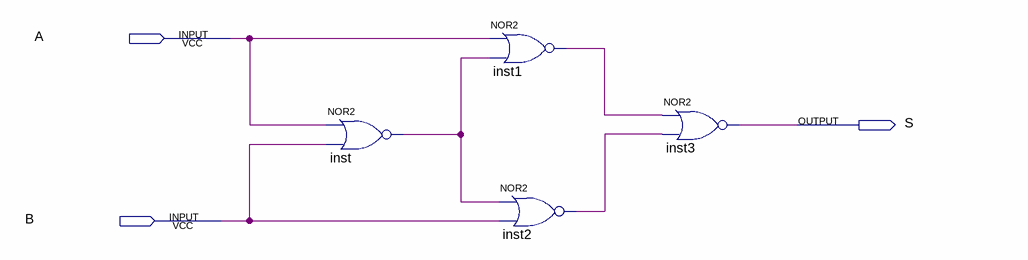
[diagram p0: schematic sheet]
// Quartus schematic AxnorB.bdf as structural Verilog: 4 symbols, 3 pins
module AxnorB (
  input  A,
  input  B,
  output S
);

  wire inst1_out, inst2_out, inst_out;

  nor inst (inst_out, A, B);
  nor inst1 (inst1_out, A, inst_out);
  nor inst2 (inst2_out, inst_out, B);
  nor inst3 (S, inst1_out, inst2_out);
endmodule
